# Altium project Trace_5.PrjPcb
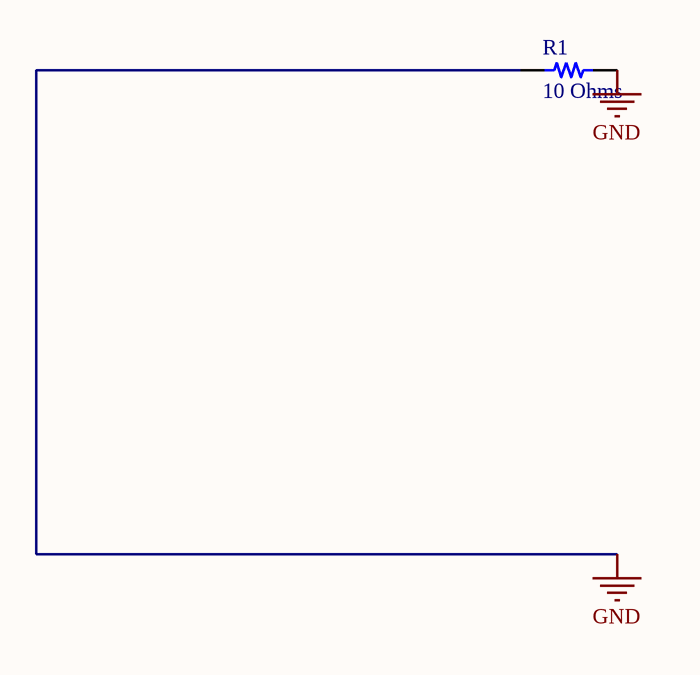
[diagram p0: trace_5.SchDoc]
1 sheet, 1 parts. Net scope: global (net labels, ports and power ports of the same name join across sheets).
Board file: Trace_5.PcbDoc

## Sheet trace_5.SchDoc
size A4; SheetNumber: 1; SheetTotal: 1

### Parts
R1  10 Ohms  [RES 0201_0603]

### Nets
GND: R1.1 R1.2

### Notes on the sheet
- TITLE:
- DOCUMENT NAME:
- AUTHOR :
- REVIEWER:
- This document is created by/ for Mitai. Any further questions can be asked through
- Sheet
- PART NO.:
- of
- DATE:
- *
- TEMPLATE:
- team@mitai.ai.
- A4
- Contact Address:Rosenheimer Straße 116b,81669, München.

### Library data of the parts
R1 = CRG0201F10R: RES SMD 10 OHM 1% 1/20W 0201; Manufacturer: TE Connectivity Passive Product; Power (Watts): 0.05W, 1/20W; Temperature Coefficient: ±400ppm/°C; Part Number: CRG0201F10R; Value: 10 Ohms; ComponentLink1Description: Datasheet; ComponentLink1URL: https://www.te.com/commerce/DocumentDelivery/DDEController?Action=srchrtrv&DocNm=1773204&DocType=DS&DocLang=English; ComponentLink2Description: DigiKey Link; ComponentLink2URL: https://www.digikey.com/en/products/detail/te-connectivity-passive-product/CRG0201F10R/4489648; Composition: Thick Film; Device Package: 0201 (0603 Metric); Height - Seated (Max): 0.010" (0.26mm); LastUpdated: 29/08/2023 19:18:34; Lifecycle Status: Active; Minimum Order: 1; Number of Terminations: 2; Operating Temperature: -55°C ~ 155°C; Package / Case: 0201 (0603 Metric); Packaging: TapeAndReel; PartId: 3; Part Status: Active; Price: 0.02; Resistance: 10 Ohms; Series: CRG, Neohm; Size / Dimension: 0.024" L x 0.012" W (0.60mm x 0.30mm); Supplier 1: DigiKey; Supplier Part Number 1: A129573CT-ND; Supplier Device Package: 0201; Tolerance: ±1%